# Altium schematic sheet 05_MCU_STM32F4_Interface.SchDoc
size A4; SheetNumber: 5; SheetTotal: 9
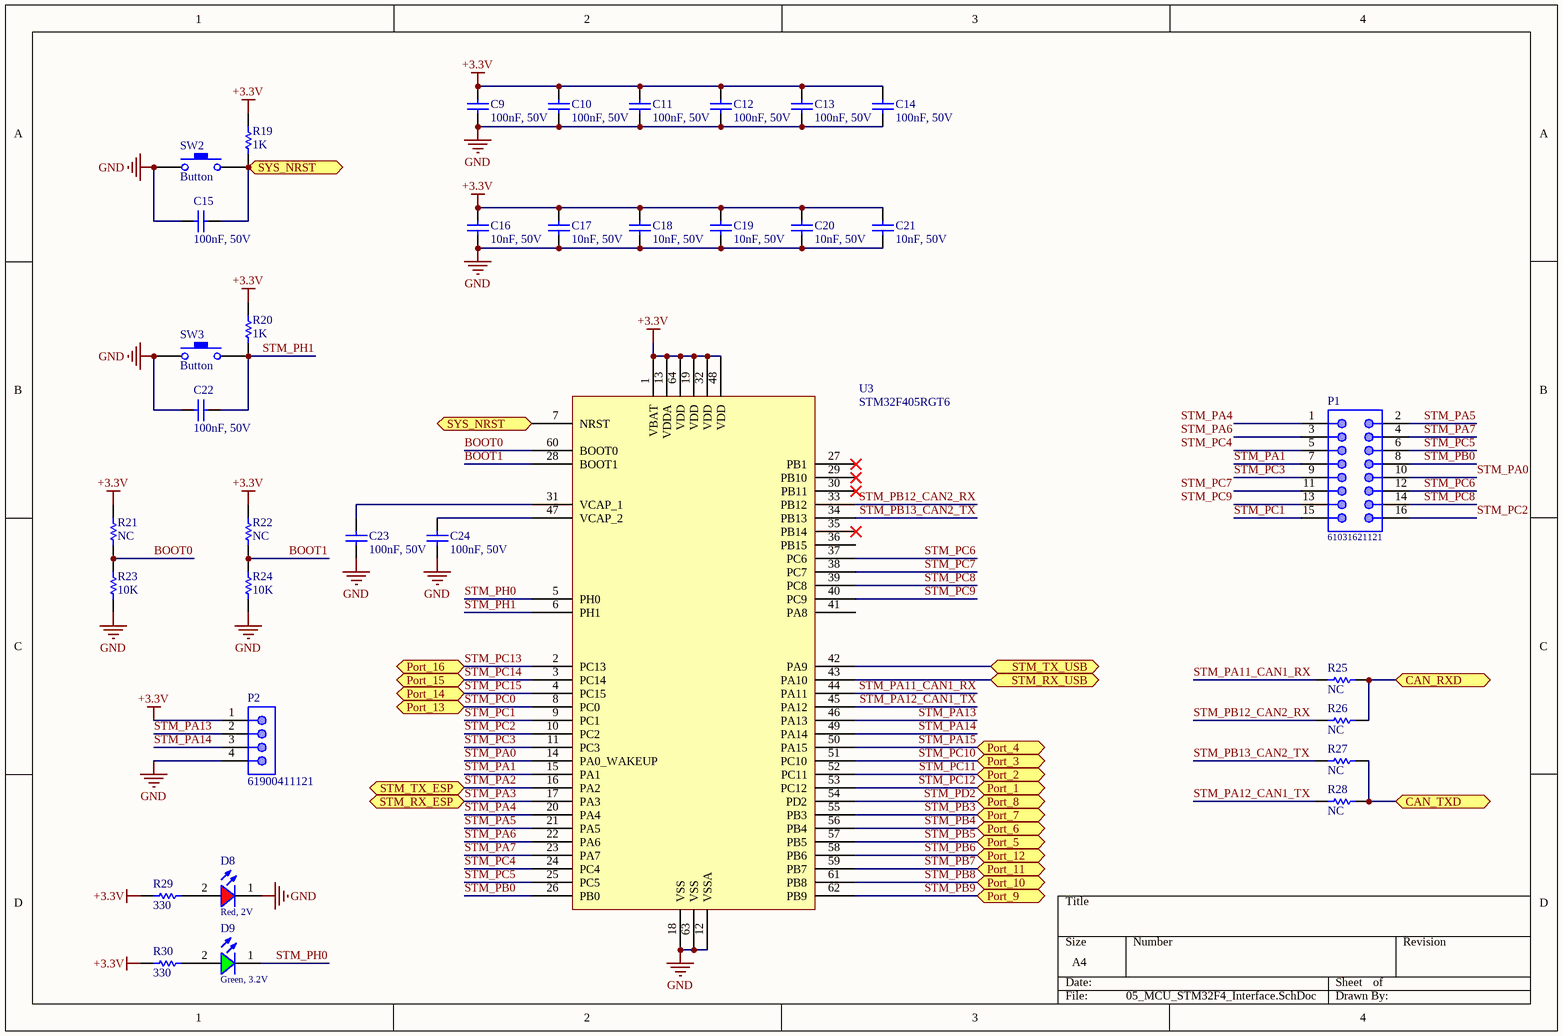
[diagram p0: 05_MCU_STM32F4_Interface.SchDoc]

## Parts
C9  100nF, 50V  [WCAP-CSGP_0603_H=0.8mm_Reflow]
C10  100nF, 50V  [WCAP-CSGP_0603_H=0.8mm_Reflow]
C11  100nF, 50V  [WCAP-CSGP_0603_H=0.8mm_Reflow]
C12  100nF, 50V  [WCAP-CSGP_0603_H=0.8mm_Reflow]
C13  100nF, 50V  [WCAP-CSGP_0603_H=0.8mm_Reflow]
C14  100nF, 50V  [WCAP-CSGP_0603_H=0.8mm_Reflow]
C15  100nF, 50V  [WCAP-CSGP_0603_H=0.8mm_Reflow]
C16  10nF, 50V  [WCAP-CSGP_0603_H=0.8mm_Reflow]
C17  10nF, 50V  [WCAP-CSGP_0603_H=0.8mm_Reflow]
C18  10nF, 50V  [WCAP-CSGP_0603_H=0.8mm_Reflow]
C19  10nF, 50V  [WCAP-CSGP_0603_H=0.8mm_Reflow]
C20  10nF, 50V  [WCAP-CSGP_0603_H=0.8mm_Reflow]
C21  10nF, 50V  [WCAP-CSGP_0603_H=0.8mm_Reflow]
C22  100nF, 50V  [WCAP-CSGP_0603_H=0.8mm_Reflow]
C23  100nF, 50V  [WCAP-CSGP_0603_H=0.8mm_Reflow]
C24  100nF, 50V  [WCAP-CSGP_0603_H=0.8mm_Reflow]
D8  Red, 2V  [WL-SMCW_0603_H=0.7mm]
D9  Green, 3.2V  [WL-SMCW_0603_H=0.7mm]
P1  61031621121  [61031621121]
P2  61900411121  [61900411121]
R19  value 1K  [RES-SM-0603]  (hidden comment: RESISTOR SMD)
R20  value 1K  [RES-SM-0603]  (hidden comment: RESISTOR SMD)
R21  value NC  [RES-SM-0603]  (hidden comment: RESISTOR SMD)
R22  value NC  [RES-SM-0603]  (hidden comment: RESISTOR SMD)
R23  value 10K  [RES-SM-0603]  (hidden comment: RESISTOR SMD)
R24  value 10K  [RES-SM-0603]  (hidden comment: RESISTOR SMD)
R25  value NC  [RES-SM-0603]  (hidden comment: RESISTOR SMD)
R26  value NC  [RES-SM-0603]  (hidden comment: RESISTOR SMD)
R27  value NC  [RES-SM-0603]  (hidden comment: RESISTOR SMD)
R28  value NC  [RES-SM-0603]  (hidden comment: RESISTOR SMD)
R29  value 330  [RES-SM-0603]  (hidden comment: RESISTOR SMD)
R30  value 330  [RES-SM-0603]  (hidden comment: RESISTOR SMD)
SW2  Button  [Button 4-pin SMD]
SW3  Button  [Button 4-pin SMD]
U3  STM32F405RGT6  [CQFP50P1150X1150X160-64N]

## Ports
CAN_RXD (bidir), CAN_TXD (bidir), Port_1 (bidir), Port_2 (bidir), Port_3 (bidir), Port_4 (bidir), Port_5 (bidir), Port_6 (bidir), Port_7 (bidir), Port_8 (bidir), Port_9 (bidir), Port_10 (bidir), Port_11 (bidir), Port_12 (bidir), Port_13 (bidir), Port_14 (bidir), Port_15 (bidir), Port_16 (bidir), STM_RX_ESP (bidir), STM_RX_USB (bidir), STM_TX_ESP (bidir), STM_TX_USB (bidir), SYS_NRST (bidir)

## Nets
+3.3V: C9.2 C10.2 C11.2 C12.2 C13.2 C14.2 C16.2 C17.2 C18.2 C19.2 C20.2 C21.2 P2.1 R19.2 R20.2 R21.2 R22.2 R29.2 R30.2 U3.1(VBAT) U3.13(VDDA) U3.19(VDD) U3.32(VDD) U3.48(VDD) U3.64(VDD)
GND: C9.1 C10.1 C11.1 C12.1 C13.1 C14.1 C15.1 C16.1 C17.1 C18.1 C19.1 C20.1 C21.1 C22.1 C23.1 C24.1 D8.1(K) P2.4 R23.1 R24.1 SW2.1 SW3.1 U3.12(VSSA) U3.18(VSS) U3.63(VSS)
BOOT0: R21.1 R23.2 U3.60(BOOT0)
BOOT1: R22.1 R24.2 U3.28(BOOT1)
CAN_RXD: R25.2 R26.2 ; port CAN_RXD
CAN_TXD: R27.2 R28.2 ; port CAN_TXD
STM_PA0: P1.10 U3.14(PA0_WAKEUP)
STM_PA1: P1.7 U3.15(PA1)
STM_PA2: U3.16(PA2) ; port STM_TX_ESP
STM_PA3: U3.17(PA3) ; port STM_RX_ESP
STM_PA4: P1.1 U3.20(PA4)
STM_PA5: P1.2 U3.21(PA5)
STM_PA6: P1.3 U3.22(PA6)
STM_PA7: P1.4 U3.23(PA7)
STM_PA11_CAN1_RX: R25.1 U3.44(PA11)
STM_PA12_CAN1_TX: R28.1 U3.45(PA12)
STM_PA13: P2.2 U3.46(PA13)
STM_PA14: P2.3 U3.49(PA14)
STM_PA15: U3.50(PA15) ; port Port_4
STM_PB0: P1.8 U3.26(PB0)
STM_PB3: U3.55(PB3) ; port Port_7
STM_PB4: U3.56(PB4) ; port Port_6
STM_PB5: U3.57(PB5) ; port Port_5
STM_PB6: U3.58(PB6) ; port Port_12
STM_PB7: U3.59(PB7) ; port Port_11
STM_PB8: U3.61(PB8) ; port Port_10
STM_PB9: U3.62(PB9) ; port Port_9
STM_PB12_CAN2_RX: R26.1 U3.33(PB12)
STM_PB13_CAN2_TX: R27.1 U3.34(PB13)
STM_PC0: U3.8(PC0) ; port Port_13
STM_PC1: P1.15 U3.9(PC1)
STM_PC2: P1.16 U3.10(PC2)
STM_PC3: P1.9 U3.11(PC3)
STM_PC4: P1.5 U3.24(PC4)
STM_PC5: P1.6 U3.25(PC5)
STM_PC6: P1.12 U3.37(PC6)
STM_PC7: P1.11 U3.38(PC7)
STM_PC8: P1.14 U3.39(PC8)
STM_PC9: P1.13 U3.40(PC9)
STM_PC10: U3.51(PC10) ; port Port_3
STM_PC11: U3.52(PC11) ; port Port_2
STM_PC12: U3.53(PC12) ; port Port_1
STM_PC13: U3.2(PC13) ; port Port_16
STM_PC14: U3.3(PC14) ; port Port_15
STM_PC15: U3.4(PC15) ; port Port_14
STM_PD2: U3.54(PD2) ; port Port_8
STM_PH0: D9.1(K) U3.5(PH0)
STM_PH1: C22.2 R20.1 SW3.2 U3.6(PH1)
STM_RX_USB: U3.43(PA10) ; port STM_RX_USB
STM_TX_USB: U3.42(PA9) ; port STM_TX_USB
SYS_NRST: C15.2 R19.1 SW2.2 U3.7(NRST) ; port SYS_NRST
NetC23_2: C23.2 U3.31(VCAP_1)
NetC24_2: C24.2 U3.47(VCAP_2)
NetD8_2: D8.2(A) R29.1
NetD9_2: D9.2(A) R30.1

Not connected (* = marked no-connect by the designer): U3 27(PB1)* 29(PB10)* 30(PB11)* 35(PB14)* 36(PB15) 41(PA8)

## Library data of the parts
C9-C15 C22-C24 = 885012206095: WCAP-CSGP Multilayer Ceramic Chip Capacitor, General Purpose, size 0603, X7R, 100nF, 50V; Manufacturer: Wurth Elektronik; Rated Voltage: 50VDC; Isolation Resistance: >=5GOhm; Capacitance Tolerance: +/-10%; Technical Reference: X7R0603104K050DFCT10000; ComponentLink1Description: Manufacturer; ComponentLink1URL: http://www.we-online.de; ComponentLink2Description: Datasheet; ComponentLink2URL: https://www.we-online.com/catalog/datasheet/885012206095.pdf; Operating Temperature: -55 to +125degC; Packaging: Tape and Reel; Manufacturer Part Number: 885012206095; Published Date: May 2020; Ceramic Type: X7R; Dissipation Factor: =<3%; Height: 0.8mm; Mounting Technology: SMT; Size: 0603; Capacitance: 100nF
C16-C21 = 885012206089: WCAP-CSGP Multilayer Ceramic Chip Capacitor, General Purpose, size 0603, X7R, 10nF, 50V; Manufacturer: Wurth Elektronik; Rated Voltage: 50VDC; Isolation Resistance: >=10GOhm; Capacitance Tolerance: +/-10%; Technical Reference: X7R0603103K050DFCT10000; ComponentLink1Description: Manufacturer; ComponentLink1URL: http://www.we-online.de; ComponentLink2Description: Datasheet; ComponentLink2URL: https://www.we-online.com/catalog/datasheet/885012206089.pdf; Operating Temperature: -55 to +125degC; Packaging: Tape and Reel; Manufacturer Part Number: 885012206089; Published Date: May 2020; Ceramic Type: X7R; Dissipation Factor: =<2.5%; Height: 0.8mm; Mounting Technology: SMT; Size: 0603; Capacitance: 10nF
D8 = 150060RS75000: WL-SMCW SMT Mono-color Chip LED Waterclear, size 0603, Red, 2V, 140deg; Chip Technology: AlInGaP; Dominant Wavelength typ.: 625nm; Luminous Intensity typ.: 250mcd; Peak Wavelength typ.: 630nm; Viewing Angle: 140deg; ComponentLink1Description: Manufacturer; ComponentLink1URL: http://www.we-online.de; ComponentLink2URL: https://www.we-online.com/catalog/datasheet/150060RS75000.pdf; ComponentLink2Description: Datasheet; Forward Voltage typ.: 2V; Emitting Color: Red; Mounting Technology: SMT; Operating Temperature: -40 to +85degC; Published Date: December 2019; Part Number: 150060RS75000; Packaging: Tape and Reel; Size: 0603; Publisher: Wurth Elektronik
D9 = 150060GS75000: WL-SMCW SMT Mono-color Chip LED Waterclear, size 0603, Green, 3.2V, 140deg; Chip Technology: InGaN; Dominant Wavelength typ.: 525nm; Luminous Intensity typ.: 430mcd; Peak Wavelength typ.: 515nm; Viewing Angle: 140deg; ComponentLink1Description: Manufacturer; ComponentLink1URL: http://www.we-online.de; ComponentLink2URL: https://www.we-online.com/catalog/datasheet/150060GS75000.pdf; ComponentLink2Description: Datasheet; Forward Voltage typ.: 3.2V; Emitting Color: Green; Mounting Technology: SMT; Operating Temperature: -40 to +85degC; Published Date: December 2019; Part Number: 150060GS75000; Packaging: Tape and Reel; Size: 0603; Publisher: Wurth Elektronik
P1 = 61031621121: WR-PHD Pin Header, SMT, pitch 2.54mm, Dual Row, Vertical, 16p; Manufacturer: Wurth Elektronik; Pin Number: 16; Rated Current: 3A; Working Voltage: 250VAC; Withstanding Voltage: 500VAC; Contact Resistance: 20mOhm; ComponentLink1Description: Manufacturer; ComponentLink1URL: http://www.we-online.de; ComponentLink2Description: Datasheet; ComponentLink2URL: https://www.we-online.com/catalog/datasheet/61031621121.pdf; Manufacturer Part Number: 61031621121; Published Date: May 2020; Pitch: 2.54mm; Operating Temperature: -40 to +125degC; Mounting Technology: SMT; Packaging: Tape and Reel; Gender: Pin Header; Row Number: Dual; Orientation: Vertical
P2 = 61900411121: WR-WTB THT Male Vertical Locking Header, pitch 2.54mm, 4p; Pin Number: 4; Contact Resistance: 20mOhm; Rated Current: 3A; Withstanding Voltage: 1000VAC; Working Voltage: 250VAC; ComponentLink1Description: Manufacturer; ComponentLink1URL: http://www.we-online.de; ComponentLink2Description: Datasheet; ComponentLink2URL: https://www.we-online.com/catalog/datasheet/61900411121.pdf; Pitch: 2.54mm; Published Date: January 2020; Publisher: Wurth Elektronik; Mounting Technology: THT; Packaging: Bag; Operating Temperature: -40 to +105degC; Part Number: 61900411121; Gender: Male; Type: Vertical
R19-R30 = RESISTOR SMD: Resistor
U3 = STM32F405RGT6: Manufacturer: ST; ComponentLink1Description: Supplier 1 Link